# EAGLE schematic Valve Driver V4.1 (EAGLE 6.4)
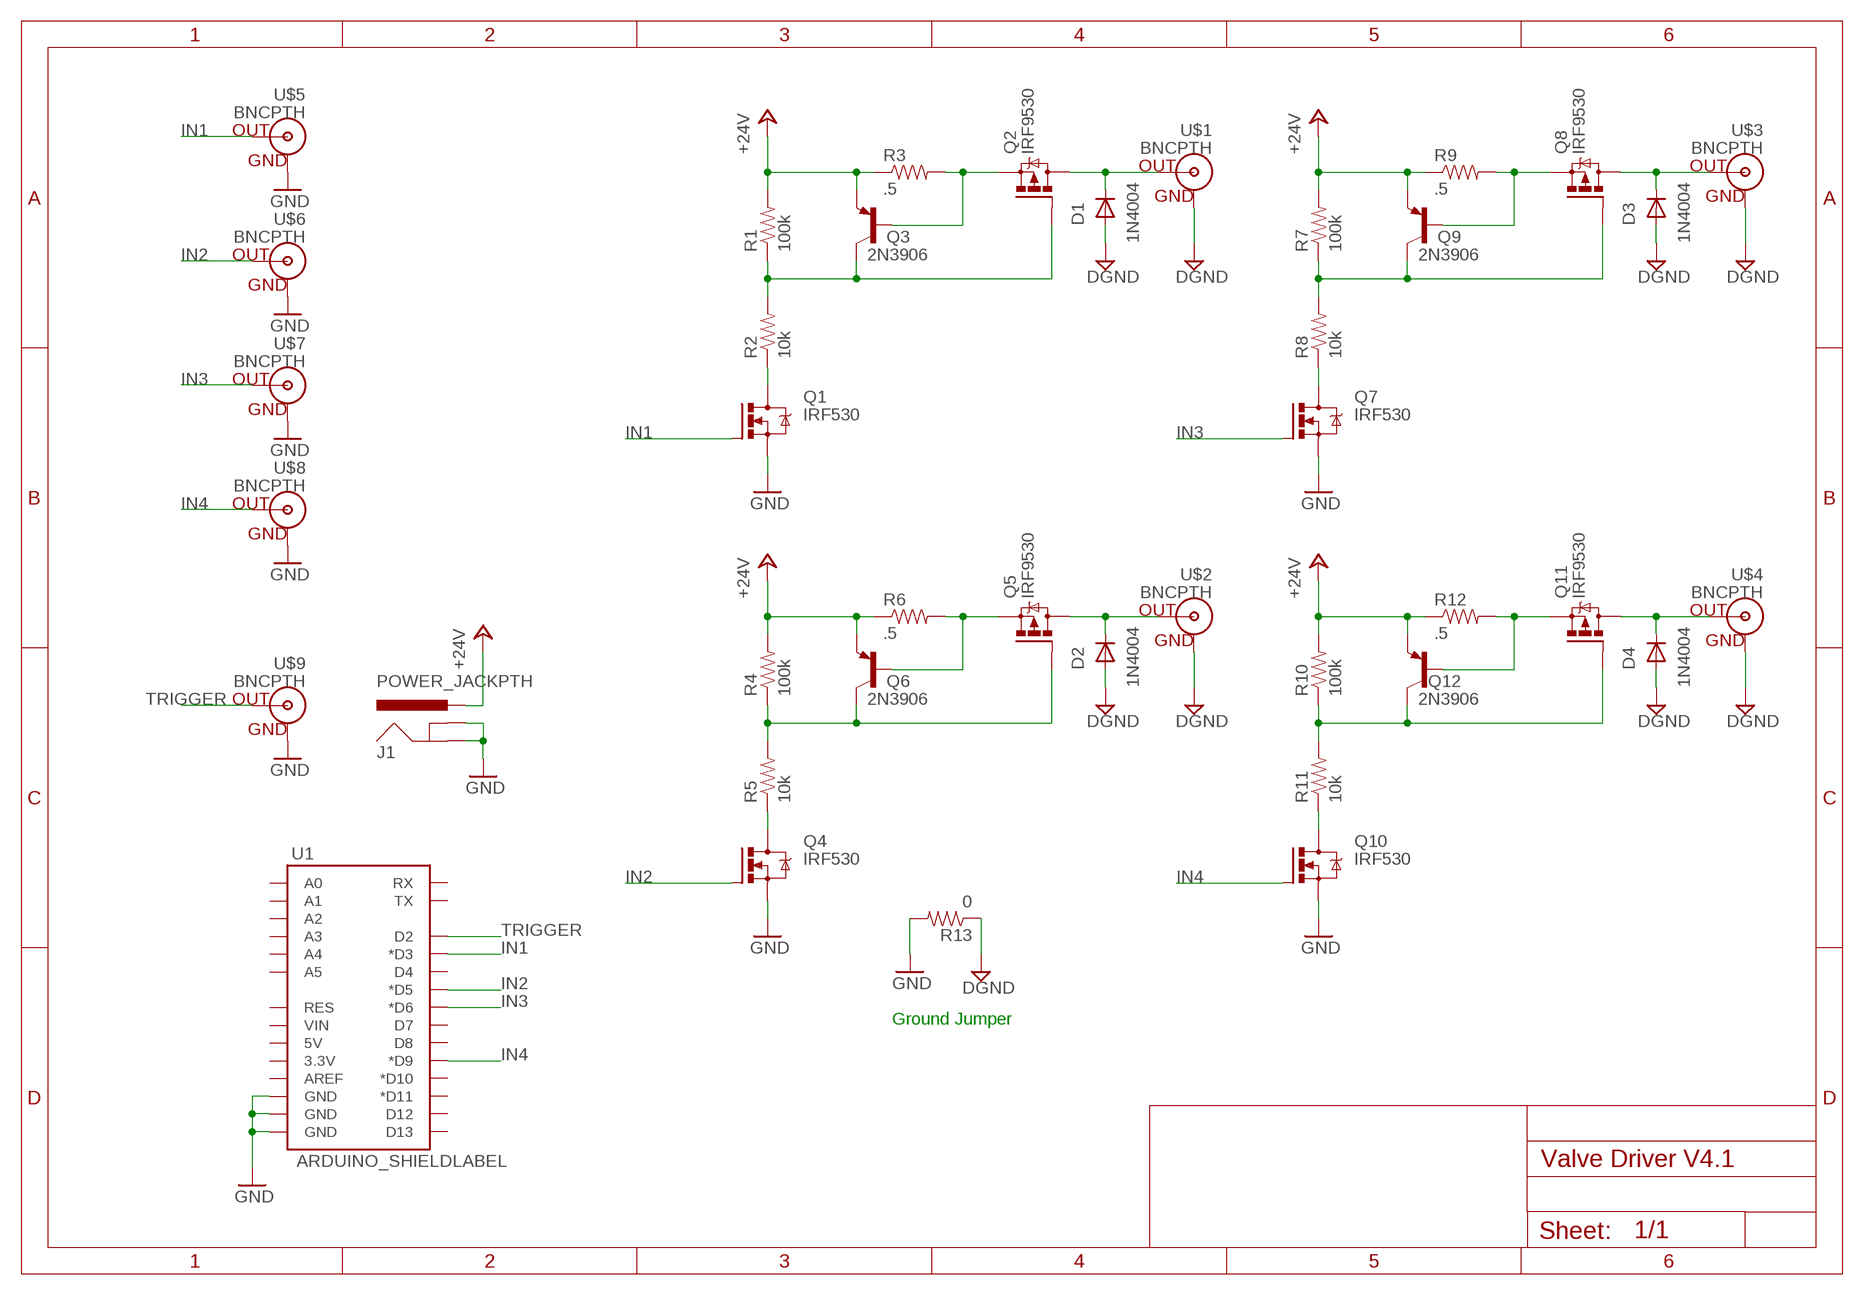
[diagram p0: schematic, sheet 1]

## Parts
D1  1N4004  [DO41-10]
D2  1N4004  [DO41-10]
D3  1N4004  [DO41-10]
D4  1N4004  [DO41-10]
J1  POWER_JACKPTH  [POWER_JACK_PTH]
Q1  IRF530  IRF530TO220  [TO220BV]
Q2  IRF9530  [TO220BV]
Q3  2N3906  [TO92]
Q4  IRF530  IRF530TO220  [TO220BV]
Q5  IRF9530  [TO220BV]
Q6  2N3906  [TO92]
Q7  IRF530  IRF530TO220  [TO220BV]
Q8  IRF9530  [TO220BV]
Q9  2N3906  [TO92]
Q10  IRF530  IRF530TO220  [TO220BV]
Q11  IRF9530  [TO220BV]
Q12  2N3906  [TO92]
R1  100k  RESISTORPTH-1/4W  [AXIAL-0.4]
R2  10k  RESISTORPTH-1/4W  [AXIAL-0.4]
R3  .5  RESISTORPTH-1/4W  [AXIAL-0.4]
R4  100k  RESISTORPTH-1/4W  [AXIAL-0.4]
R5  10k  RESISTORPTH-1/4W  [AXIAL-0.4]
R6  .5  RESISTORPTH-1/4W  [AXIAL-0.4]
R7  100k  RESISTORPTH-1/4W  [AXIAL-0.4]
R8  10k  RESISTORPTH-1/4W  [AXIAL-0.4]
R9  .5  RESISTORPTH-1/4W  [AXIAL-0.4]
R10  100k  RESISTORPTH-1/4W  [AXIAL-0.4]
R11  10k  RESISTORPTH-1/4W  [AXIAL-0.4]
R12  .5  RESISTORPTH-1/4W  [AXIAL-0.4]
R13  0  RESISTORPTH-1/4W  [AXIAL-0.4]
U1  ARDUINO_SHIELDLABEL  [DUEMILANOVE_SHIELD]
U$1  BNCPTH  [BNC]
U$2  BNCPTH  [BNC]
U$3  BNCPTH  [BNC]
U$4  BNCPTH  [BNC]
U$5  BNCPTH  [BNC]
U$6  BNCPTH  [BNC]
U$7  BNCPTH  [BNC]
U$8  BNCPTH  [BNC]
U$9  BNCPTH  [BNC]

## Nets
+24V: J1.PWR Q3.3(E) Q6.3(E) Q9.3(E) Q12.3(E) R1.P$2 R3.P$1 R4.P$2 R6.P$1 R7.P$2 R9.P$1 R10.P$2 R12.P$1
DGND: D1.A D2.A D3.A D4.A R13.P$1 U$1.GND U$2.GND U$3.GND U$4.GND
GND: J1.GND J1.GNDBREAK Q1.S Q4.S Q7.S Q10.S R13.P$2 U1.GND@0(GND) U1.GND@1(GND) U1.GND@2(GND) U$5.GND U$6.GND U$7.GND U$8.GND U$9.GND
IN1: Q1.G U1.D3(*D3) U$5.S(OUT)
IN2: Q4.G U1.D5(*D5) U$6.S(OUT)
IN3: Q7.G U1.D6(*D6) U$7.S(OUT)
IN4: Q10.G U1.D9(*D9) U$8.S(OUT)
N$1: Q2.G Q3.1(C) R1.P$1 R2.P$2
N$2: Q1.D R2.P$1
N$3: Q2.S Q3.2(B) R3.P$2
N$4: D1.C Q2.D U$1.S(OUT)
N$5: Q5.G Q6.1(C) R4.P$1 R5.P$2
N$6: Q4.D R5.P$1
N$7: Q5.S Q6.2(B) R6.P$2
N$8: D2.C Q5.D U$2.S(OUT)
N$9: Q8.G Q9.1(C) R7.P$1 R8.P$2
N$10: Q7.D R8.P$1
N$11: Q8.S Q9.2(B) R9.P$2
N$12: D3.C Q8.D U$3.S(OUT)
N$13: Q11.G Q12.1(C) R10.P$1 R11.P$2
N$14: Q10.D R11.P$1
N$15: Q11.S Q12.2(B) R12.P$2
N$16: D4.C Q11.D U$4.S(OUT)
TRIGGER: U1.D2 U$9.S(OUT)
Unconnected: U1.3.3V U1.5V U1.A0 U1.A1 U1.A2 U1.A3 U1.A4 U1.A5 U1.AREF U1.D4 U1.D7 U1.D8 U1.D10(*D10) U1.D11(*D11) U1.D12 U1.D13 U1.RES U1.RX U1.TX U1.VIN

## Notes on the sheet
- Ground Jumper

## Library data of the parts
D1-D4 = diode:1N4004: DIODE general purpose rectifier, 1 A
J1 = SparkFun-Connectors:POWER_JACK: Power Jack This is the standard 5.5mm barrel jack for power. The PTH is the most common, proven, reliable, footprint. The Slot footprint only works if the mill layer is transmitted to the PCB fab house so be warned. Spark Fun Electronics SKU : PRT-00119 SMT: CONN-08106 Mating wall wart : TOL-00298 (and others)
Q1 Q4 Q7 Q10 = transistor-power:IRF530: HEXFET Power MOSFET
Q2 Q5 Q8 Q11 = transistor-power:IRF9530: P-CHANNEL HEXFET POWER-MOS-FET Source: http://www.irf.com/product-info/datasheets/data/irf9530.pdf
Q3 Q6 Q9 Q12 = transistor-pnp:2N3906: PNP Transistor
R1-R13 = SparkFun:RESISTOR: Resistor Basic schematic elements and footprints for 0603, 1206, and PTH resistors.
U1 = SparkFun-Boards:ARDUINO_SHIELD: Arduino shield footprint
U$1-U$9 = SparkFun-Connectors:BNC: BNC Connector, Mouser Part# 5227161

## Net classes
0 default: width 1.27 mm, clearance 0.635 mm